# EAGLE design ShrewSpecsHat-1-2 (EAGLE 9.6.2)
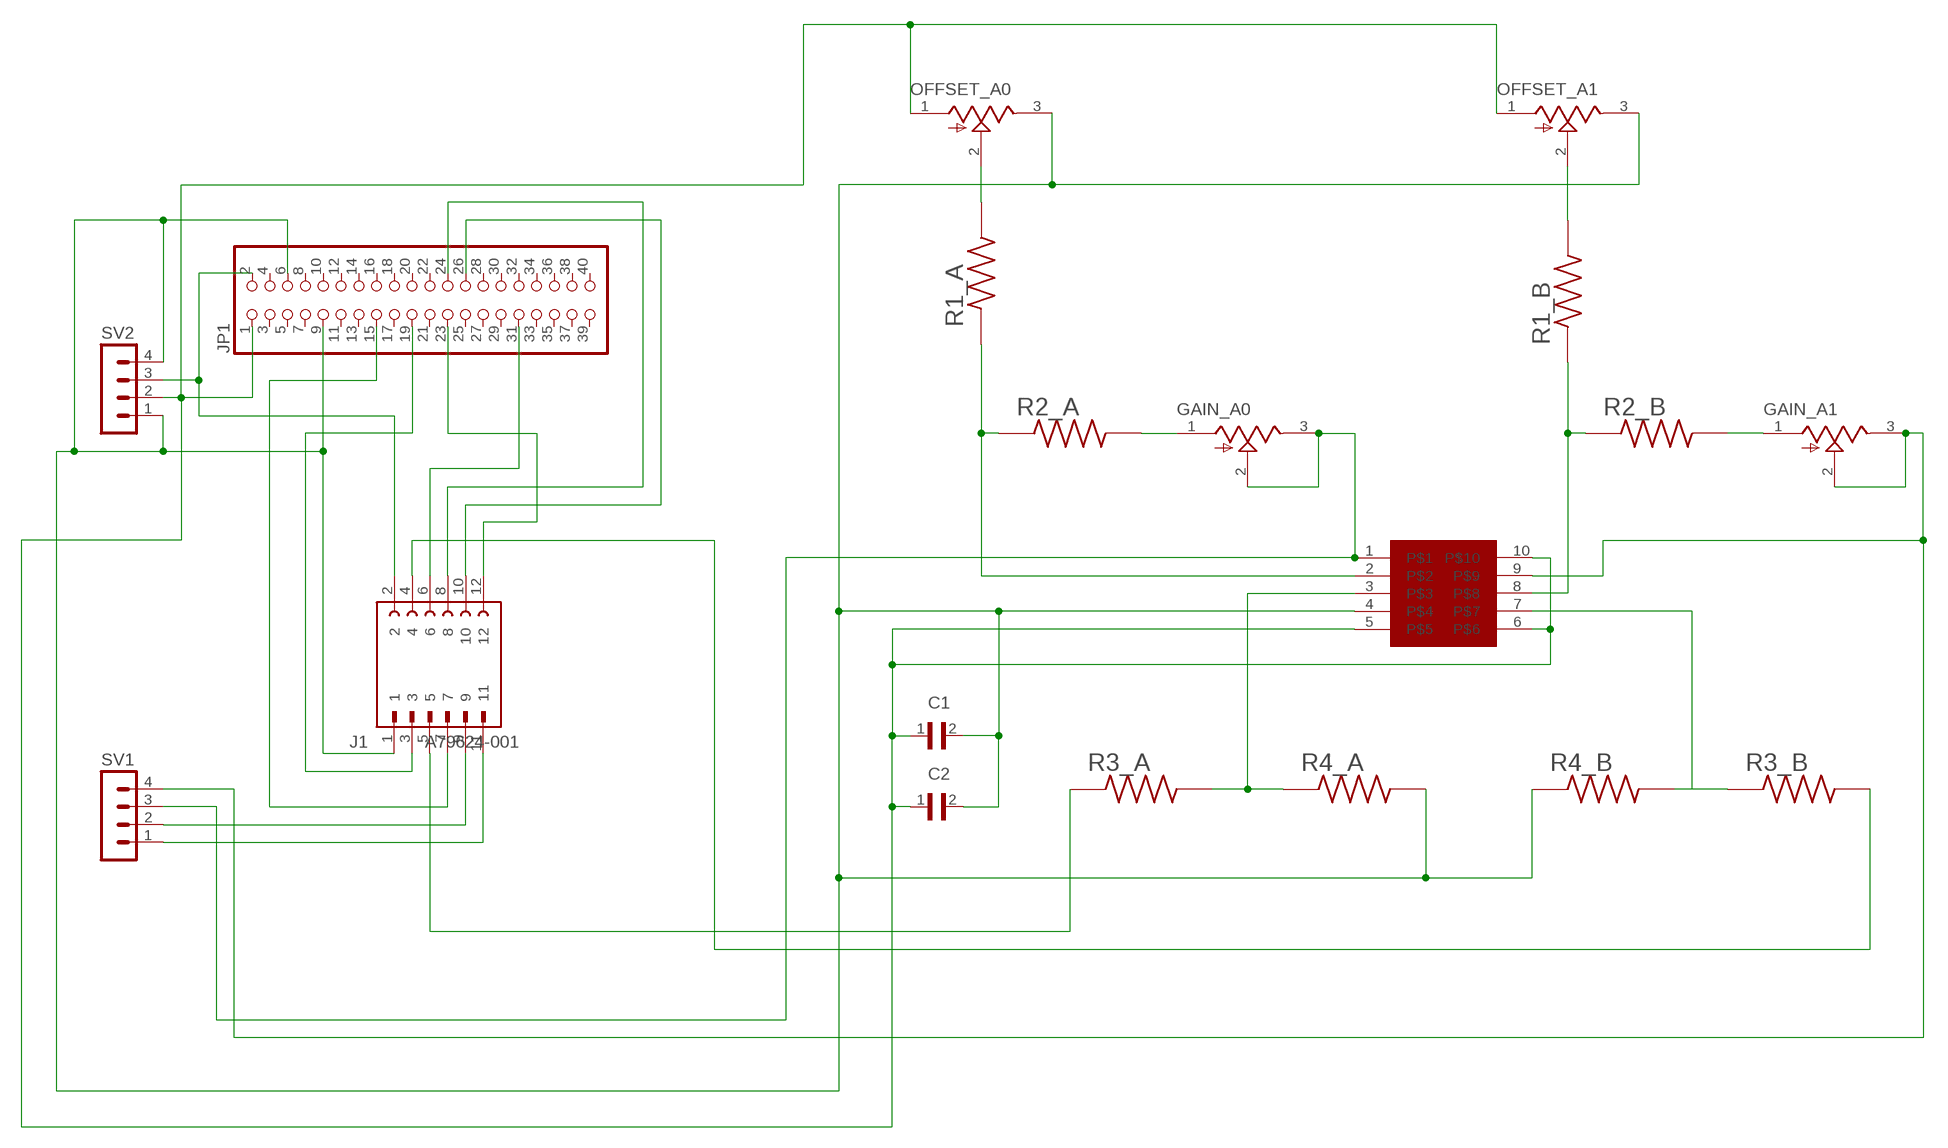
[diagram p0: schematic, sheet 1]

## Parts
C1  CL21A106KOQNNNE  [CAPC2012X140N]
C2  CL21A106KOQNNNE  [CAPC2012X140N]
GAIN_A0  3362P-1-203LF  [TRIM_3362P-1-203LF]
GAIN_A1  3362P-1-203LF  [TRIM_3362P-1-203LF]
J1  A79624-001  [OMNETICS_A79624-001]
JP1  PINHD-2X20-BIG  [2X20-BIG]
OFFSET_A0  3362P-1-203LF  [TRIM_3362P-1-203LF]
OFFSET_A1  3362P-1-203LF  [TRIM_3362P-1-203LF]
R1_A  RC0805FR-07100RL  [RESC2012X60N]
R1_B  RC0805FR-07100RL  [RESC2012X60N]
R2_A  RC0805FR-07100RL  [RESC2012X60N]
R2_B  RC0805FR-07100RL  [RESC2012X60N]
R3_A  RC0805FR-07100RL  [RESC2012X60N]
R3_B  RC0805FR-07100RL  [RESC2012X60N]
R4_A  RC0805FR-07100RL  [RESC2012X60N]
R4_B  RC0805FR-07100RL  [RESC2012X60N]
SV1  MA04-1  [MA04-1]
SV2  MA04-1  [MA04-1]
U$1  SOP50P490X110-10N  [SOP50P490X110-10N]

## Nets
N$1: C1.1 C2.1 JP1.1 OFFSET_A0.1(CCW) OFFSET_A1.1(CCW) SV2.2 U$1.5 U$1.6 U$1.10
N$2: J1.4 R3_B.2
N$3: J1.6 JP1.31
N$4: J1.12 JP1.23
N$5: J1.8 JP1.24
N$6: J1.10 JP1.26
N$8: J1.3 JP1.19
N$9: J1.5 R3_A.1
N$10: J1.7 JP1.15
N$11: J1.9 SV1.2
N$12: J1.11 SV1.1
N$15: J1.2 JP1.2 SV2.3
N$16: GAIN_A0.2(WIPER) GAIN_A0.3(CW) SV1.3 U$1.1
N$17: GAIN_A1.2(WIPER) GAIN_A1.3(CW) SV1.4 U$1.9
N$19: GAIN_A1.1(CCW) R2_B.2
N$20: R1_B.1 R2_B.1 U$1.8
N$21: OFFSET_A1.2(WIPER) R1_B.2
N$22: OFFSET_A0.2(WIPER) R1_A.2
N$23: R1_A.1 R2_A.1 U$1.2
N$25: GAIN_A0.1(CCW) R2_A.2
N$26: R3_A.2 R4_A.1 U$1.3
N$27: R3_B.1 R4_B.2 U$1.7
N$29: C1.2 C2.2 J1.1 JP1.6 JP1.9 OFFSET_A0.3(CW) OFFSET_A1.3(CW) R4_A.2 R4_B.1 SV2.1 SV2.4 U$1.4
Unconnected: JP1.3 JP1.4 JP1.5 JP1.7 JP1.8 JP1.10 JP1.11 JP1.12 JP1.13 JP1.14 JP1.16 JP1.17 JP1.18 JP1.20 JP1.21 JP1.22 JP1.25 JP1.27 JP1.28 JP1.29 JP1.30 JP1.32 JP1.33 JP1.34 JP1.35 JP1.36 JP1.37 JP1.38 JP1.39 JP1.40

## Library data of the parts
C1 C2 = CL21A106KOQNNNE:CL21A106KOQNNNE; A_MAX: 1.4; A_MIN: 1.4; A_NOM: 1.4; D_MAX: 2.15; D_MIN: 1.85; D_NOM: 2.0; E_MAX: 1.4; E_MIN: 1.1; E_NOM: 1.25; L1_MAX: 0.7; L1_MIN: 0.2; L1_NOM: 0.5; L_MAX: 0.7; L_MIN: 0.2; L_NOM: 0.5; MANUFACTURER: Samsung Electro-Mechanics; STANDARD: IPC 7351B
GAIN_A0 GAIN_A1 OFFSET_A0 OFFSET_A1 = 3362P-1-203LF:3362P-1-203LF; MF: Bourns; MP: 3362P-1-205LF; PARTREV: 08/26/10; STANDARD: Manufacturer Recommendation
J1 = A79624-001:A79624-001; CREATOR: DIZAR; MANUFACTURER: Omnetics; MAXIMUM_PACKAGE_HEIGHT: 4.826mm; PARTREV: E; STANDARD: Manufacturer Recommendations
JP1 = adafruit:PINHD-2X20: PIN HEADER
R1_A R1_B R2_A R2_B R3_A R3_B R4_A R4_B = RC0805FR-07100RL:RC0805FR-07100RL: Resistor SMD [YAGEO] RC0805FR-07100RL Resistor SMD
SV1 SV2 = con-lstb:MA04-1: PIN HEADER; OC_FARNELL: unknown; OC_NEWARK: unknown
U$1 = OPA2355DGSA_250:SOP50P490X110-10N

## Board
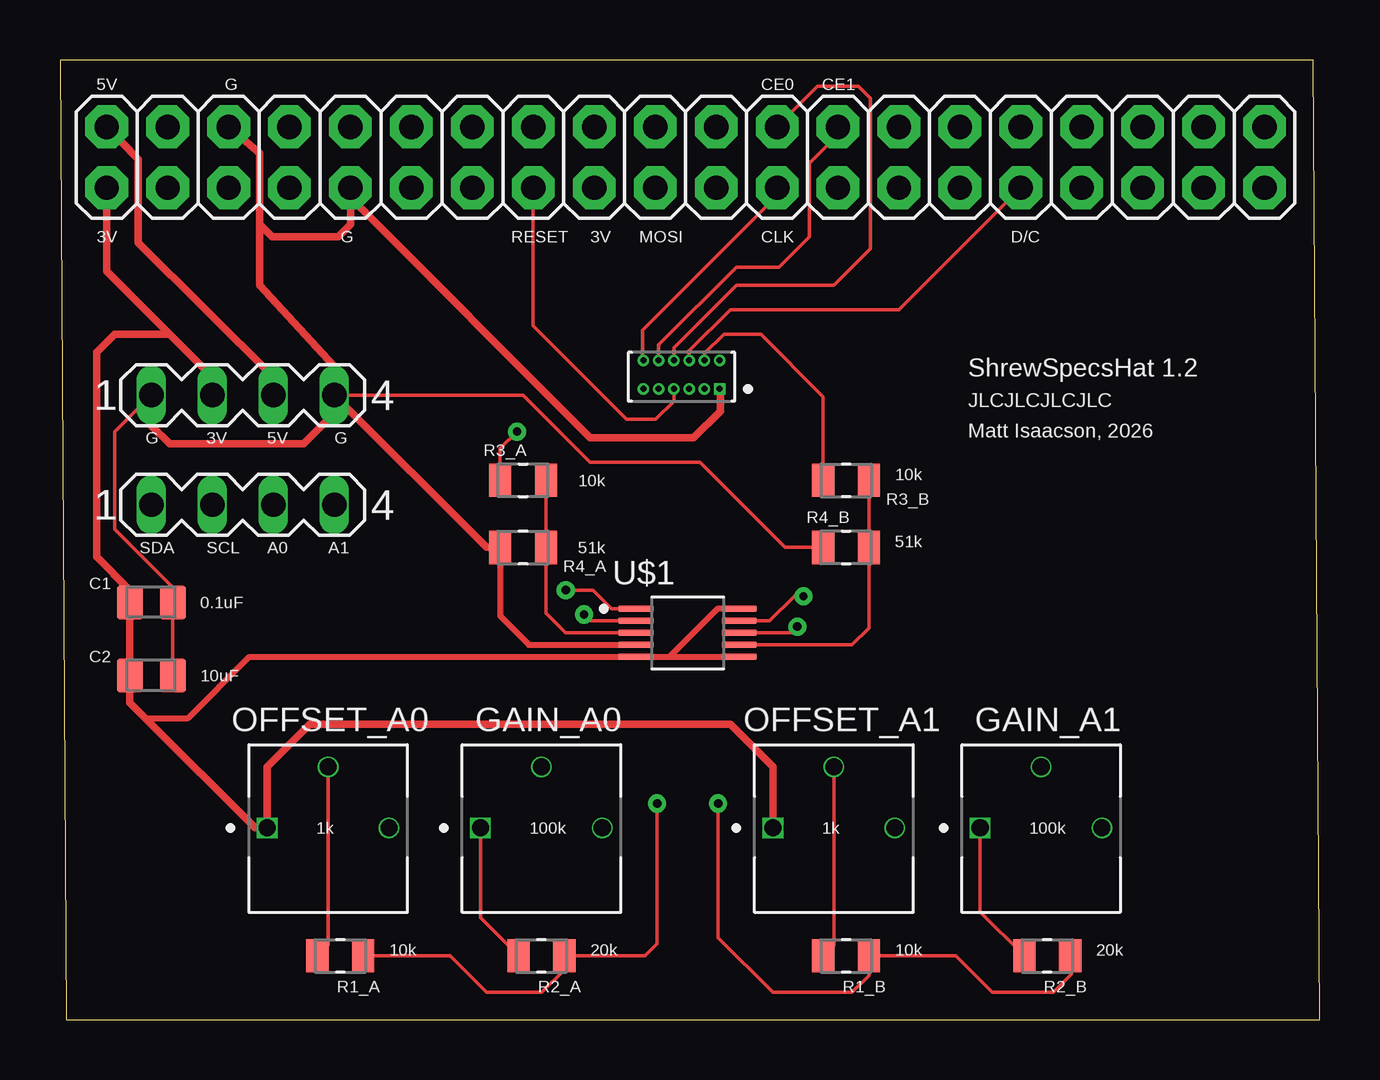
[diagram p1: board, top side]
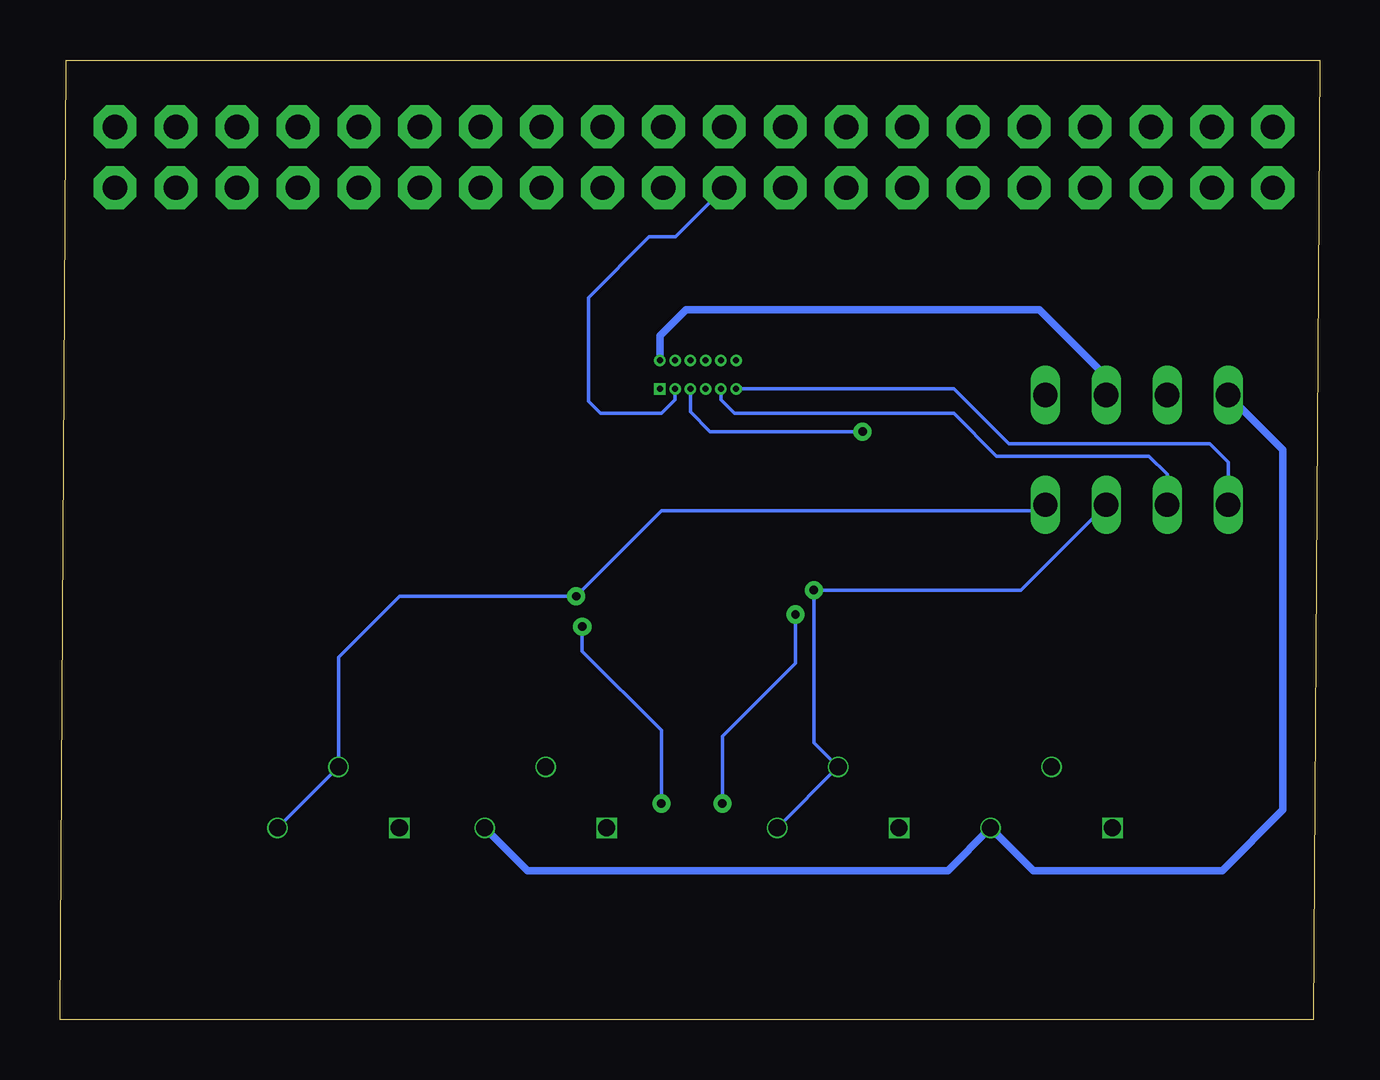
[diagram p2: board, bottom side, seen from below]

Size 52.5 x 40 mm. Coordinates in mm from the lower left corner, seen from the top.
Outline: 0.25,0 52.5,0 52.25,40 0,40 0.25,0
Copper layers (1*16): Top 0.035mm / dielectric 1.5mm / Bottom 0.035mm
Design rules "default *": minimum track width 6mil, minimum drill 0.35mm, track to track 6mil, track to pad 6mil, pad to pad 6mil, via to via 6mil, smd to smd 6mil, copper to edge 40mil, drill to drill 6mil, minimum pad ring 2mil, minimum via ring 8mil, stop-mask expansion 4mil, vias tented up to drill 0mil, thermal gap 10mil

### Footprints (pad centres in the part's own frame; a part is rotated, then mirrored left to right if it is on the bottom)
CAPC2012X140N = smd 1.08 x 1.42: 1 -0.895,0; 2 0.895,0
TRIM_3362P-1-203LF = drill 0.714 square: 1 -2.54,0 | drill 0.714: 2 0,2.54; 3 2.54,0
OMNETICS_A79624-001 = drill 0.25 pad 0.483 square: 1 -1.587,0.508 | drill 0.25 pad 0.483: 2 -1.587,-0.686; 3 -0.953,0.508; 4 -0.953,-0.686; 5 -0.318,0.508; 6 -0.318,-0.686; 7 0.318,0.508; 8 0.318,-0.686; 9 0.953,0.508; 10 0.953,-0.686; 11 1.587,0.508; 12 1.587,-0.686
2X20-BIG = drill 1.016 pad 1.778 octagon: 1 -24.13,-1.27; 2 -24.13,1.27; 3 -21.59,-1.27; 4 -21.59,1.27; 5 -19.05,-1.27; 6 -19.05,1.27; 7 -16.51,-1.27; 8 -16.51,1.27; 9 -13.97,-1.27; 10 -13.97,1.27; 11 -11.43,-1.27; 12 -11.43,1.27; 13 -8.89,-1.27; 14 -8.89,1.27; 15 -6.35,-1.27; 16 -6.35,1.27; 17 -3.81,-1.27; 18 -3.81,1.27; 19 -1.27,-1.27; 20 -1.27,1.27; 21 1.27,-1.27; 22 1.27,1.27; 23 3.81,-1.27; 24 3.81,1.27; 25 6.35,-1.27; 26 6.35,1.27; 27 8.89,-1.27; 28 8.89,1.27; 29 11.43,-1.27; 30 11.43,1.27; 31 13.97,-1.27; 32 13.97,1.27; 33 16.51,-1.27; 34 16.51,1.27; 35 19.05,-1.27; 36 19.05,1.27; 37 21.59,-1.27; 38 21.59,1.27; 39 24.13,-1.27; 40 24.13,1.27
RESC2012X60N = smd 0.92 x 1.38: 1 -0.955,0; 2 0.955,0
MA04-1 = drill 1.016 long: 1 -3.81,0; 2 -1.27,0; 3 1.27,0; 4 3.81,0
SOP50P490X110-10N = smd 1.47 x 0.28: 1 -2.15,1; 2 -2.15,0.5; 3 -2.15,0; 4 -2.15,-0.5; 5 -2.15,-1; 6 2.15,-1; 7 2.15,-0.5; 8 2.15,0; 9 2.15,0.5; 10 2.15,1

### Placement (x,y rotation side)
C1  3.81,17.4 0 top
C2  3.81,14.35 0 top
GAIN_A0  20.07,8 0 top
GAIN_A1  40.89,8 0 top
J1  25.91,26.8 180 top
JP1  26.08,35.94 0 top
OFFSET_A0  11.18,8 0 top
OFFSET_A1  32.26,8 0 top
R1_A  11.68,2.67 180 top
R1_B  32.77,2.67 180 top
R2_A  20.07,2.67 180 top
R2_B  41.15,2.67 180 top
R3_A  19.3,22.48 0 top
R3_B  32.77,22.48 180 top
R4_A  19.3,19.68 180 top
R4_B  32.77,19.68 0 top
SV1  7.62,21.46 0 top
SV2  7.62,26.04 0 top
U$1  26.16,16.13 0 top

### Tracks (layer width: path | path; a pad name or v marks a point on that pad's centre or on a via)
N$1
  Top 0.152: 2.91,17.91 C1.1
  Top 0.254: 3.56,12.57 5.33,12.57 7.89,15.13 U$1.5 25.4,15.13 | 25.4,15.13 U$1.6 | U$1.10 27.4,17.13 25.4,15.13
  Top 0.305: JP1.1 1.95,31.2 4.57,28.57 | SV2.2 6.35,26.8 4.57,28.57 | 4.57,28.57 2.29,28.57 1.52,27.81 1.52,19.3 2.91,17.91 | C1.1 C2.1 2.91,13.21 3.56,12.57 8.13,8 OFFSET_A0.1 8.64,10.54 10.41,12.32 27.94,12.32 29.72,10.54 OFFSET_A1.1
N$2
  Top 0.152: J1.4 26.86,27.77 27.67,28.57 29.21,28.57 31.81,25.97 R3_B.2
N$3
  Top 0.152: JP1.31 34.97,29.59 27.94,29.59 26.23,27.88 J1.6
N$4
  Top 0.152: JP1.23 29.89,34.33 24.29,28.73 24.29,27.51 J1.12
N$5
  Top 0.152: J1.8 25.59,28 28.19,30.61 32.26,30.61 33.78,32.13 33.78,38.4 33.27,38.9 31.58,38.9 JP1.24
N$6
  Top 0.152: JP1.26 32.43,36.87 31.24,35.69 31.24,32.64 29.97,31.37 28.19,31.37 24.96,28.13 J1.10
N$8
  Bottom 0.152: JP1.19 26.84,32.64 27.94,32.64 30.48,30.1 30.48,25.78 29.97,25.27 27.43,25.27 26.86,25.85 J1.3
N$9  (via drill 0.35)
  Top 0.152: R3_A.1 18.35,23.81 v19.05,24.51
  Bottom 0.152: J1.5 26.23,25.34 25.4,24.51 v19.05,24.51
N$10
  Top 0.152: JP1.15 19.73,28.91 23.62,25.02 24.83,25.02 25.59,25.78 J1.7
N$11
  Bottom 0.152: J1.9 24.96,25.85 24.38,25.27 15.24,25.27 13.46,23.5 7.11,23.5 6.35,22.73 SV1.2
N$12
  Bottom 0.152: SV1.1 3.81,23.24 4.57,24 12.95,24 15.24,26.29 J1.11
N$15
  Top 0.305: JP1.2 3.25,35.86 3.25,32.37 8.89,26.79 SV2.3
  Bottom 0.305: SV2.3 8.89,26.8 11.68,29.59 26.42,29.59 27.5,28.51 J1.2
N$16  (via drill 0.35)
  Top 0.152: v21.08,17.91 22.22,17.91 23,17.13 U$1.1
  Bottom 0.152: SV1.3 12.45,17.91 v21.08,17.91 21.08,11.56 GAIN_A0.2 GAIN_A0.3
N$17  (via drill 0.35)
  Top 0.152: U$1.9 29.58,16.63 30.61,17.65 v30.99,17.65
  Bottom 0.152: SV1.4 11.68,21.21 27.43,21.21 v30.99,17.65 38.35,17.65 40.89,15.11 GAIN_A1.2 GAIN_A1.3
N$19
  Top 0.152: GAIN_A1.1 38.35,4.51 R2_B.2
N$20  (via drill 0.35)
  Top 0.152: R2_B.1 42.16,2.61 42.16,1.91 41.4,1.14 38.86,1.14 37.34,2.67 R1_B.1 33.72,1.84 33.02,1.14 29.72,1.14 27.43,3.43 v27.43,9.02 | U$1.8 30.48,16.13 v30.73,16.38
  Bottom 0.152: v30.73,16.38 30.73,15.37 27.43,12.06 v27.43,9.02
N$21
  Top 0.152: OFFSET_A1.2 32.26,3.11 R1_B.2
N$22
  Top 0.152: OFFSET_A0.2 11.18,3.11 R1_A.2
N$23  (via drill 0.35)
  Top 0.152: R1_A.1 16.26,2.67 17.78,1.14 20.07,1.14 21.02,2.1 R2_A.1 24.38,2.67 24.89,3.17 v24.89,9.02 | U$1.2 22.11,16.63 v21.84,16.89
  Bottom 0.152: v24.89,9.02 24.89,11.81 21.84,14.86 v21.84,16.89
N$25
  Top 0.152: R2_A.2 17.53,4.25 GAIN_A0.1
N$26
  Top 0.152: R3_A.2 R4_A.1 20.26,16.95 21.08,16.13 U$1.3
N$27
  Top 0.152: R3_B.1 R4_B.2 33.72,16.32 33.02,15.62 U$1.7
N$29
  Top 0.152: 27.53,26.29 J1.1 | SV2.1 2.29,24.51 2.29,20.45 4.71,18.03 C1.2 C2.2 | R4_B.1 30.23,19.68 26.67,23.24 22.1,23.24 19.3,26.04 SV2.4
  Top 0.254: R4_A.2 18.35,16.83 19.55,15.63 U$1.4
  Top 0.305: JP1.6 8.33,36.11 8.33,33.15 | SV2.4 11.43,27.24 8.33,30.61 8.33,33.15 | SV2.4 11.43,25.27 10.16,24 4.57,24 3.81,24.76 SV2.1 | 27.53,26.29 27.53,25.37 26.42,24.26 22.1,24.26 12.11,34.25 JP1.9 12.11,33.15 11.6,32.64 8.84,32.64 8.33,33.15 | SV2.4 17.78,19.68 R4_A.2
  Bottom 0.305: SV2.1 1.52,23.75 1.52,8.76 4.06,6.22 11.94,6.22 OFFSET_A0.3 15.49,6.22 33.02,6.22 OFFSET_A1.3

### Text on the board
tNames: 5V | G | CE0 | CE1 | 3V | G | RESET | 3V | MOSI | CLK | D/C | ShrewSpecsHat 1.2 | JLCJLCJLCJLC | G | 3V | 5V | G | Matt Isaacson, 2026 | 10k | 10k | SDA | SCL | A0 | A1 | 51k | 51k | 0.1uF | 10uF | 1k | 100k | 1k | 100k | 10k | 20k | 10k | 20k